# Altium schematic sheet USBandPOWER.SchDoc
size A4
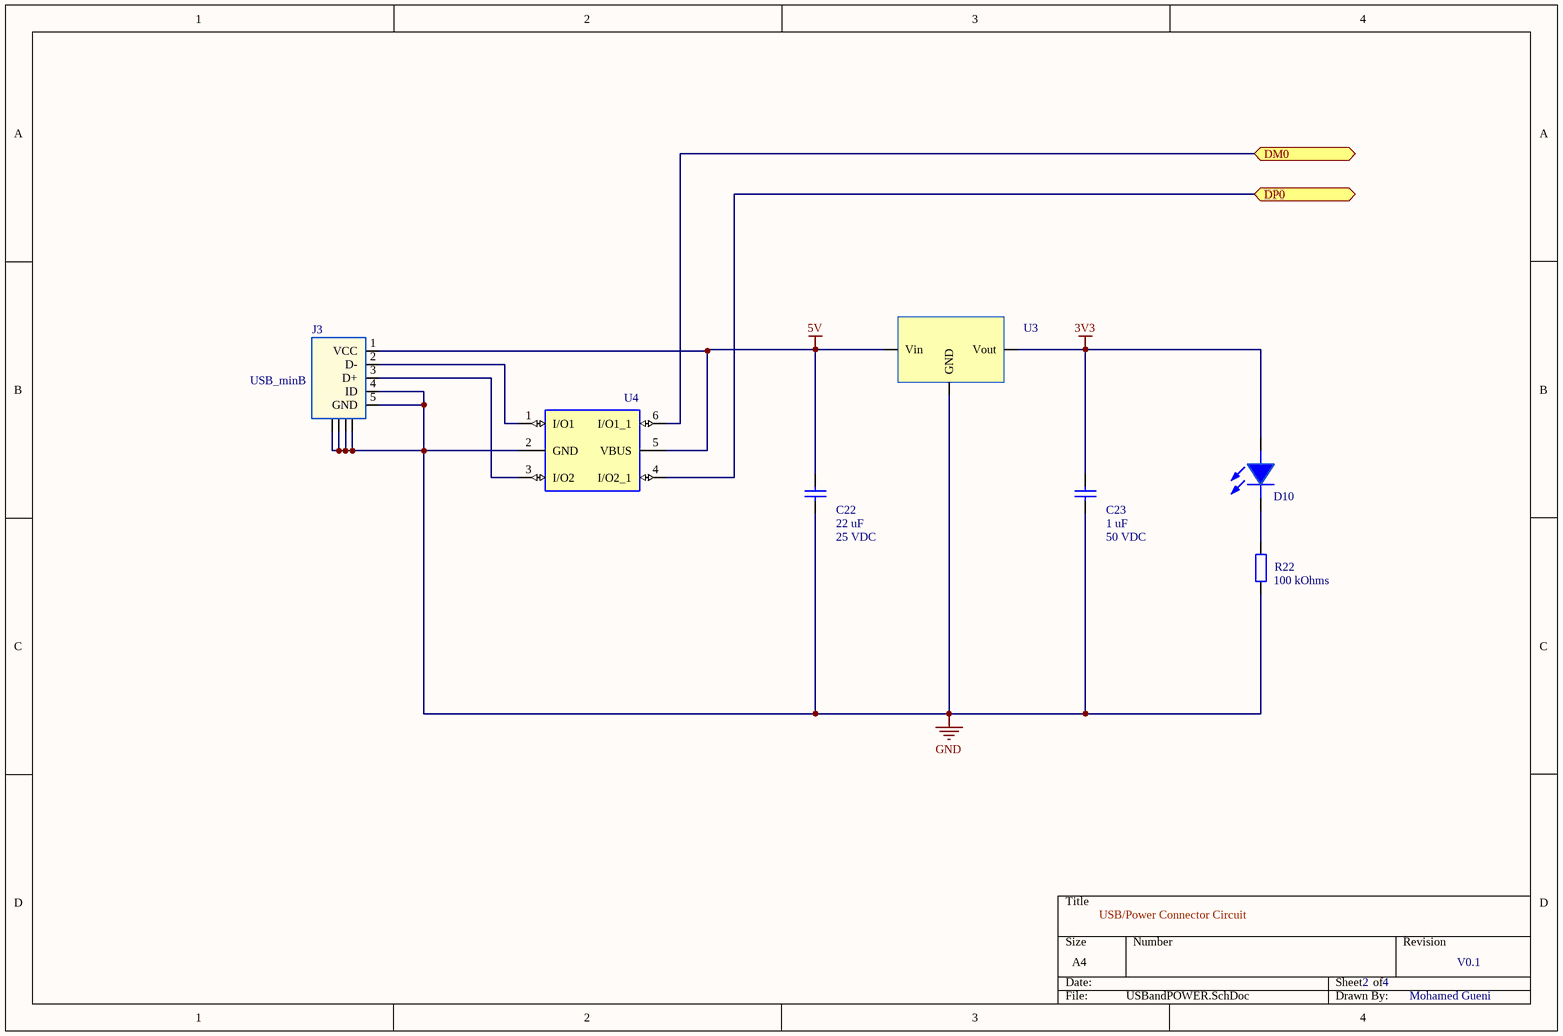
[diagram p0: USBandPOWER.SchDoc]

## Parts
C22  Value 1: 22 uF  Value 2: 25 VDC  [CAP-1210]  (hidden comment: Capacitor)
C23  Value 1: 1 uF  Value 2: 50 VDC  [CAP-1210]  (hidden comment: Capacitor)
D10  SML-H12U8TT86C  [LEDC2012X90N]  (value not drawn)
J3  USB_minB  [XM7D-0512]
R22  Value 1: 100 kOhms  [R0603]  (hidden comment: Resistor)
U3  Voltage Regulator  [REG-SOT230P700X180-4N]  (value not drawn)
U4  USBLC6-2SC6  [SOT95P280X145]  (value not drawn)

## Ports
DM0 (bidir), DP0 (bidir)

## Nets
3V3: C23.2 D10.2(A) U3.3(Vout)
5V: C22.2 J3.1(VCC) U3.2(Vin) U4.5(VBUS)
GND: C22.1 C23.1 J3.4(ID) J3.5(GND) J3.SH1(SHIELD) R22.1 U3.1(GND) U4.2(GND)
DM0: U4.6(I/O1_1) ; port DM0
DP0: U4.4(I/O2_1) ; port DP0
NetD10_1: D10.1(K) R22.2
NetJ3_2: J3.2(D-) U4.1(I/O1)
NetJ3_3: J3.3(D+) U4.3(I/O2)

## Notes on the sheet
- USB/Power Connector Circuit
- 2
- 4
- V0.1
- Mohamed Gueni

## Library data of the parts
C22 = C-000000004: DES: Multilayer Ceramic Capacitors MLCC - SMD/SMT 22 uF 25 VDC 10% 1210 X7R; MAN: Murata Electronics; MANREF: GRM32ER71E226KE15L; SUP: Mouser; SUPREF: 81-GRM32ER71E226KE5L; TOL: 10 %; FTP: 1210; NOTE: _; Part Number: C-000000004
C23 = C-000000005: DES: Multilayer Ceramic Capacitors MLCC - SMD/SMT 50V 1uF X7R 1210 10%; MAN: TAIYO YUDEN; MANREF: UMK325B7105KH-T; SUP: Mouser; SUPREF: 963-UMK325B7105KH-T; TOL: 10 %; FTP: 1210; NOTE: _; Part Number: C-000000005
D10 = LED-000000002: DES: Standard LEDs - SMD Red 620nm 40mcd 2.2V; 20mA; 0603; MAN: ROHM Semiconductor; SUP: Mouser; SUPREF: 755-SML-H12U8TT86C; Value 1: 20 mA; Value 2: 2.2 V; N°: LED-000000002; MANREF: SML-H12U8TT86C; Footprint: 0805 (2012 metric); DataSheet: https://eu.mouser.com/datasheet/2/348/sml-h1(c)-e-1508182.pdf
J3 = J-000000003: MAN: USB Connectors USB RightAngle DIP MiniB AuContact 5Pin; MANREF: Omron; FTP: THT; SUP: Mouser; SUPREF: 653-XM7D-0512; NOTE: End of Life: Scheduled for obsolescence and will be discontinued by the manufacturer.; Part Number: J-000000003; DES: XM7D-0512
R22 = R-000000002: TOL: 1 %; DES: Thick Film Resistors - SMD 1/10watt 100Kohms 1%; MAN: Vishay; MANREF: CRCW0603100KFKEA; SUP: Mouser; SUPREF: 71-CRCW0603-100K-E3; Value 2: 100 mW; Part Number: R-000000002; FTP: R0603; NOTE: -
U3 = U-000000004: DES: XC6203E332FR-G; MAN: LDO Voltage Regulators; MANREF: Torex Semiconductor; SUP: 3.3 V; Value 2: SOT-223-3; Value 1: Mouser; TOL: 865-XC6203E332FR-G; FTP: 8 V; Part Number: U-000000004; NOTE: https://eu.mouser.com/datasheet/2/760/XC6203-846590.pdf
U4 = U-000000006: MAN: ESD Suppressors / TVS Diodes ESD Protection Low Cap; MANREF: STMicroelectronics; Value 1: Mouser; Value 2: SOT-666; TOL: 511-USBLC6-2SC6; DES: USBLC6-2SC6; Part Number: U-000000006; NOTE: https://eu.mouser.com/datasheet/2/389/usblc6-2-957370.pdf